# EAGLE design MainMatrix (EAGLE 9.0.1)
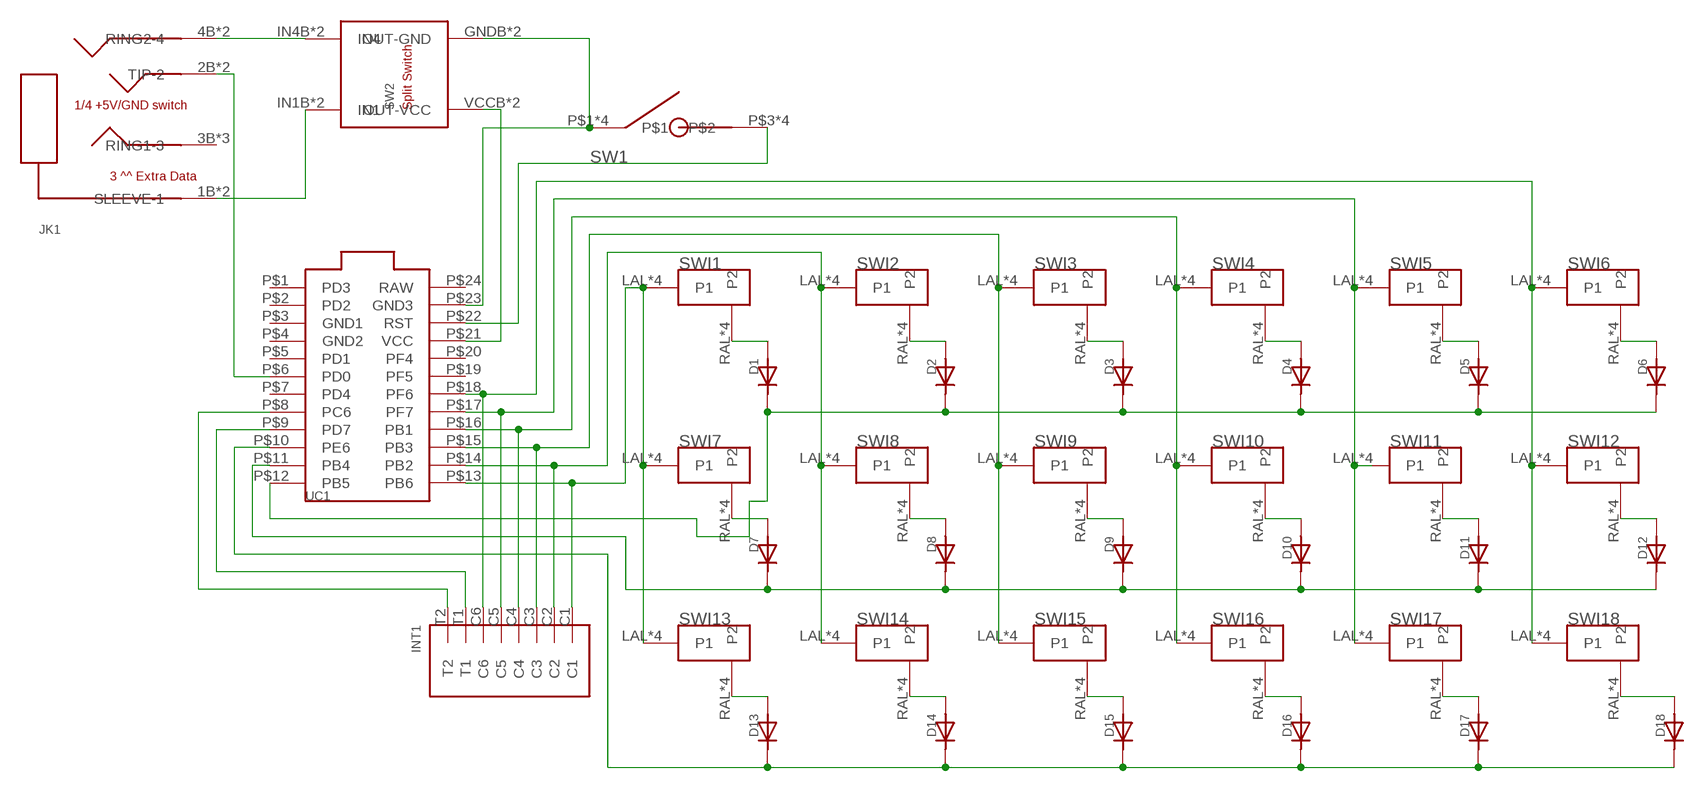
[diagram p0: schematic, sheet 1]

## Parts
D1  DIODE  [DIODE_COMBO]
D2  DIODE  [DIODE_COMBO]
D3  DIODE  [DIODE_COMBO]
D4  DIODE  [DIODE_COMBO]
D5  DIODE  [DIODE_COMBO]
D6  DIODE  [DIODE_COMBO]
D7  DIODE  [DIODE_COMBO]
D8  DIODE  [DIODE_COMBO]
D9  DIODE  [DIODE_COMBO]
D10  DIODE  [DIODE_COMBO]
D11  DIODE  [DIODE_COMBO]
D12  DIODE  [DIODE_COMBO]
D13  DIODE  [DIODE_COMBO]
D14  DIODE  [DIODE_COMBO]
D15  DIODE  [DIODE_COMBO]
D16  DIODE  [DIODE_COMBO]
D17  DIODE  [DIODE_COMBO]
D18  DIODE  [DIODE_COMBO]
INT1  INTRCNNT  [INTRCNNT]
JK1  TRRSJACK  [TRRSJACK]
SW1  RSTSWSMD  [FLATSWT]
SW2  TRANSFERPADDY  [TRANSFER_PADS]
SWI1  MX/ALPSDOUBLESIDED  [DOUBLED_MX/ALPS]
SWI2  MX/ALPSDOUBLESIDED  [DOUBLED_MX/ALPS]
SWI3  MX/ALPSDOUBLESIDED  [DOUBLED_MX/ALPS]
SWI4  MX/ALPSDOUBLESIDED  [DOUBLED_MX/ALPS]
SWI5  MX/ALPSDOUBLESIDED  [DOUBLED_MX/ALPS]
SWI6  MX/ALPSDOUBLESIDED  [DOUBLED_MX/ALPS]
SWI7  MX/ALPSDOUBLESIDED  [DOUBLED_MX/ALPS]
SWI8  MX/ALPSDOUBLESIDED  [DOUBLED_MX/ALPS]
SWI9  MX/ALPSDOUBLESIDED  [DOUBLED_MX/ALPS]
SWI10  MX/ALPSDOUBLESIDED  [DOUBLED_MX/ALPS]
SWI11  MX/ALPSDOUBLESIDED  [DOUBLED_MX/ALPS]
SWI12  MX/ALPSDOUBLESIDED  [DOUBLED_MX/ALPS]
SWI13  MX/ALPSDOUBLESIDED  [DOUBLED_MX/ALPS]
SWI14  MX/ALPSDOUBLESIDED  [DOUBLED_MX/ALPS]
SWI15  MX/ALPSDOUBLESIDED  [DOUBLED_MX/ALPS]
SWI16  MX/ALPSDOUBLESIDED  [DOUBLED_MX/ALPS]
SWI17  MX/ALPSDOUBLESIDED  [DOUBLED_MX/ALPS]
SWI18  MX/ALPSDOUBLESIDED  [DOUBLED_MX/ALPS]
UC1  PROMICROUNDER  [PROMICRO_UNDER]

## Nets
N$1: INT1.C5 SWI5.LAL(P1) SWI5.LAR(P1) SWI5.LCL(P1) SWI5.LCR(P1) SWI11.LAL(P1) SWI11.LAR(P1) SWI11.LCL(P1) SWI11.LCR(P1) SWI17.LAL(P1) SWI17.LAR(P1) SWI17.LCL(P1) SWI17.LCR(P1) UC1.P$17(PF7)
N$2: D1.ANOSB(AN) D1.ANOST(AN) D1.ANOT(AN) SWI1.RAL(P2) SWI1.RAR(P2) SWI1.RCL(P2) SWI1.RCR(P2)
N$3: D2.ANOSB(AN) D2.ANOST(AN) D2.ANOT(AN) SWI2.RAL(P2) SWI2.RAR(P2) SWI2.RCL(P2) SWI2.RCR(P2)
N$4: D3.ANOSB(AN) D3.ANOST(AN) D3.ANOT(AN) SWI3.RAL(P2) SWI3.RAR(P2) SWI3.RCL(P2) SWI3.RCR(P2)
N$5: D4.ANOSB(AN) D4.ANOST(AN) D4.ANOT(AN) SWI4.RAL(P2) SWI4.RAR(P2) SWI4.RCL(P2) SWI4.RCR(P2)
N$6: D5.ANOSB(AN) D5.ANOST(AN) D5.ANOT(AN) SWI5.RAL(P2) SWI5.RAR(P2) SWI5.RCL(P2) SWI5.RCR(P2)
N$7: D6.ANOSB(AN) D6.ANOST(AN) D6.ANOT(AN) SWI6.RAL(P2) SWI6.RAR(P2) SWI6.RCL(P2) SWI6.RCR(P2)
N$8: D7.ANOSB(AN) D7.ANOST(AN) D7.ANOT(AN) SWI7.RAL(P2) SWI7.RAR(P2) SWI7.RCL(P2) SWI7.RCR(P2)
N$9: D8.ANOSB(AN) D8.ANOST(AN) D8.ANOT(AN) SWI8.RAL(P2) SWI8.RAR(P2) SWI8.RCL(P2) SWI8.RCR(P2)
N$10: D9.ANOSB(AN) D9.ANOST(AN) D9.ANOT(AN) SWI9.RAL(P2) SWI9.RAR(P2) SWI9.RCL(P2) SWI9.RCR(P2)
N$11: D10.ANOSB(AN) D10.ANOST(AN) D10.ANOT(AN) SWI10.RAL(P2) SWI10.RAR(P2) SWI10.RCL(P2) SWI10.RCR(P2)
N$12: D11.ANOSB(AN) D11.ANOST(AN) D11.ANOT(AN) SWI11.RAL(P2) SWI11.RAR(P2) SWI11.RCL(P2) SWI11.RCR(P2)
N$13: D12.ANOSB(AN) D12.ANOST(AN) D12.ANOT(AN) SWI12.RAL(P2) SWI12.RAR(P2) SWI12.RCL(P2) SWI12.RCR(P2)
N$14: D13.ANOSB(AN) D13.ANOST(AN) D13.ANOT(AN) SWI13.RAL(P2) SWI13.RAR(P2) SWI13.RCL(P2) SWI13.RCR(P2)
N$15: D14.ANOSB(AN) D14.ANOST(AN) D14.ANOT(AN) SWI14.RAL(P2) SWI14.RAR(P2) SWI14.RCL(P2) SWI14.RCR(P2)
N$16: D15.ANOSB(AN) D15.ANOST(AN) D15.ANOT(AN) SWI15.RAL(P2) SWI15.RAR(P2) SWI15.RCL(P2) SWI15.RCR(P2)
N$17: D16.ANOSB(AN) D16.ANOST(AN) D16.ANOT(AN) SWI16.RAL(P2) SWI16.RAR(P2) SWI16.RCL(P2) SWI16.RCR(P2)
N$18: D17.ANOSB(AN) D17.ANOST(AN) D17.ANOT(AN) SWI17.RAL(P2) SWI17.RAR(P2) SWI17.RCL(P2) SWI17.RCR(P2)
N$19: D18.ANOSB(AN) D18.ANOST(AN) D18.ANOT(AN) SWI18.RAL(P2) SWI18.RAR(P2) SWI18.RCL(P2) SWI18.RCR(P2)
N$20: D1.CATSB(CAT) D1.CATST(CAT) D1.CATT(CAT) D2.CATSB(CAT) D2.CATST(CAT) D2.CATT(CAT) D3.CATSB(CAT) D3.CATST(CAT) D3.CATT(CAT) D4.CATSB(CAT) D4.CATST(CAT) D4.CATT(CAT) D5.CATSB(CAT) D5.CATST(CAT) D5.CATT(CAT) D6.CATSB(CAT) D6.CATST(CAT) D6.CATT(CAT) UC1.P$12(PB5)
N$21: D7.CATSB(CAT) D7.CATST(CAT) D7.CATT(CAT) D8.CATSB(CAT) D8.CATST(CAT) D8.CATT(CAT) D9.CATSB(CAT) D9.CATST(CAT) D9.CATT(CAT) D10.CATSB(CAT) D10.CATST(CAT) D10.CATT(CAT) D11.CATSB(CAT) D11.CATST(CAT) D11.CATT(CAT) D12.CATSB(CAT) D12.CATST(CAT) D12.CATT(CAT) UC1.P$11(PB4)
N$22: D13.CATSB(CAT) D13.CATST(CAT) D13.CATT(CAT) D14.CATSB(CAT) D14.CATST(CAT) D14.CATT(CAT) D15.CATSB(CAT) D15.CATST(CAT) D15.CATT(CAT) D16.CATSB(CAT) D16.CATST(CAT) D16.CATT(CAT) D17.CATSB(CAT) D17.CATST(CAT) D17.CATT(CAT) D18.CATSB(CAT) D18.CATST(CAT) D18.CATT(CAT) UC1.P$10(PE6)
N$23: INT1.C1 SWI1.LAL(P1) SWI1.LAR(P1) SWI1.LCL(P1) SWI1.LCR(P1) SWI7.LAL(P1) SWI7.LAR(P1) SWI7.LCL(P1) SWI7.LCR(P1) SWI13.LAL(P1) SWI13.LAR(P1) SWI13.LCL(P1) SWI13.LCR(P1) UC1.P$13(PB6)
N$24: INT1.C2 SWI2.LAL(P1) SWI2.LAR(P1) SWI2.LCL(P1) SWI2.LCR(P1) SWI8.LAL(P1) SWI8.LAR(P1) SWI8.LCL(P1) SWI8.LCR(P1) SWI14.LAL(P1) SWI14.LAR(P1) SWI14.LCL(P1) SWI14.LCR(P1) UC1.P$14(PB2)
N$25: INT1.C3 SWI3.LAL(P1) SWI3.LAR(P1) SWI3.LCL(P1) SWI3.LCR(P1) SWI9.LAL(P1) SWI9.LAR(P1) SWI9.LCL(P1) SWI9.LCR(P1) SWI15.LAL(P1) SWI15.LAR(P1) SWI15.LCL(P1) SWI15.LCR(P1) UC1.P$15(PB3)
N$26: INT1.C4 SWI4.LAL(P1) SWI4.LAR(P1) SWI4.LCL(P1) SWI4.LCR(P1) SWI10.LAL(P1) SWI10.LAR(P1) SWI10.LCL(P1) SWI10.LCR(P1) SWI16.LAL(P1) SWI16.LAR(P1) SWI16.LCL(P1) SWI16.LCR(P1) UC1.P$16(PB1)
N$27: INT1.C6 SWI6.LAL(P1) SWI6.LAR(P1) SWI6.LCL(P1) SWI6.LCR(P1) SWI12.LAL(P1) SWI12.LAR(P1) SWI12.LCL(P1) SWI12.LCR(P1) SWI18.LAL(P1) SWI18.LAR(P1) SWI18.LCL(P1) SWI18.LCR(P1) UC1.P$18(PF6)
N$28: SW2.VCCB(OUT-VCC) SW2.VCCT(OUT-VCC) UC1.P$21(VCC)
N$29: INT1.T1 UC1.P$9(PD7)
N$30: JK1.4B(RING2-4) JK1.4T(RING2-4) SW2.IN4B(IN4) SW2.IN4T(IN4)
N$31: JK1.1B(SLEEVE-1) JK1.1T(SLEEVE-1) SW2.IN1B(IN1) SW2.IN1T(IN1)
N$32: JK1.2B(TIP-2) JK1.2T(TIP-2) UC1.P$6(PD0)
N$33: INT1.T2 UC1.P$8(PC6)
N$34: SW1.P$3 SW1.P$4 SW1.P$7 SW1.P$8 UC1.P$22(RST)
N$35: SW1.P$1 SW1.P$2 SW1.P$5 SW1.P$6 SW2.GNDB(OUT-GND) SW2.GNDT(OUT-GND) UC1.P$23(GND3)
Unconnected: JK1.3B(RING1-3) JK1.3T(RING1-3) JK1.EXTRA_DATA(RING1-3) UC1.P$1(PD3) UC1.P$2(PD2) UC1.P$3(GND1) UC1.P$4(GND2) UC1.P$5(PD1) UC1.P$7(PD4) UC1.P$19(PF5) UC1.P$20(PF4) UC1.P$24(RAW)

## Library data of the parts
D1-D18 = Keys:DIODE
INT1 = Keys:INTRCNNT
JK1 = Keys:TRRSJACK
SW1 = Keys:RSTSW
SW2 = Keys:TRANSFER
SWI1-SWI18 = Keys:MX/ALPS
UC1 = Keys:PROMICRO

## Net classes
0 default: clearance 0.205 mm

## Board
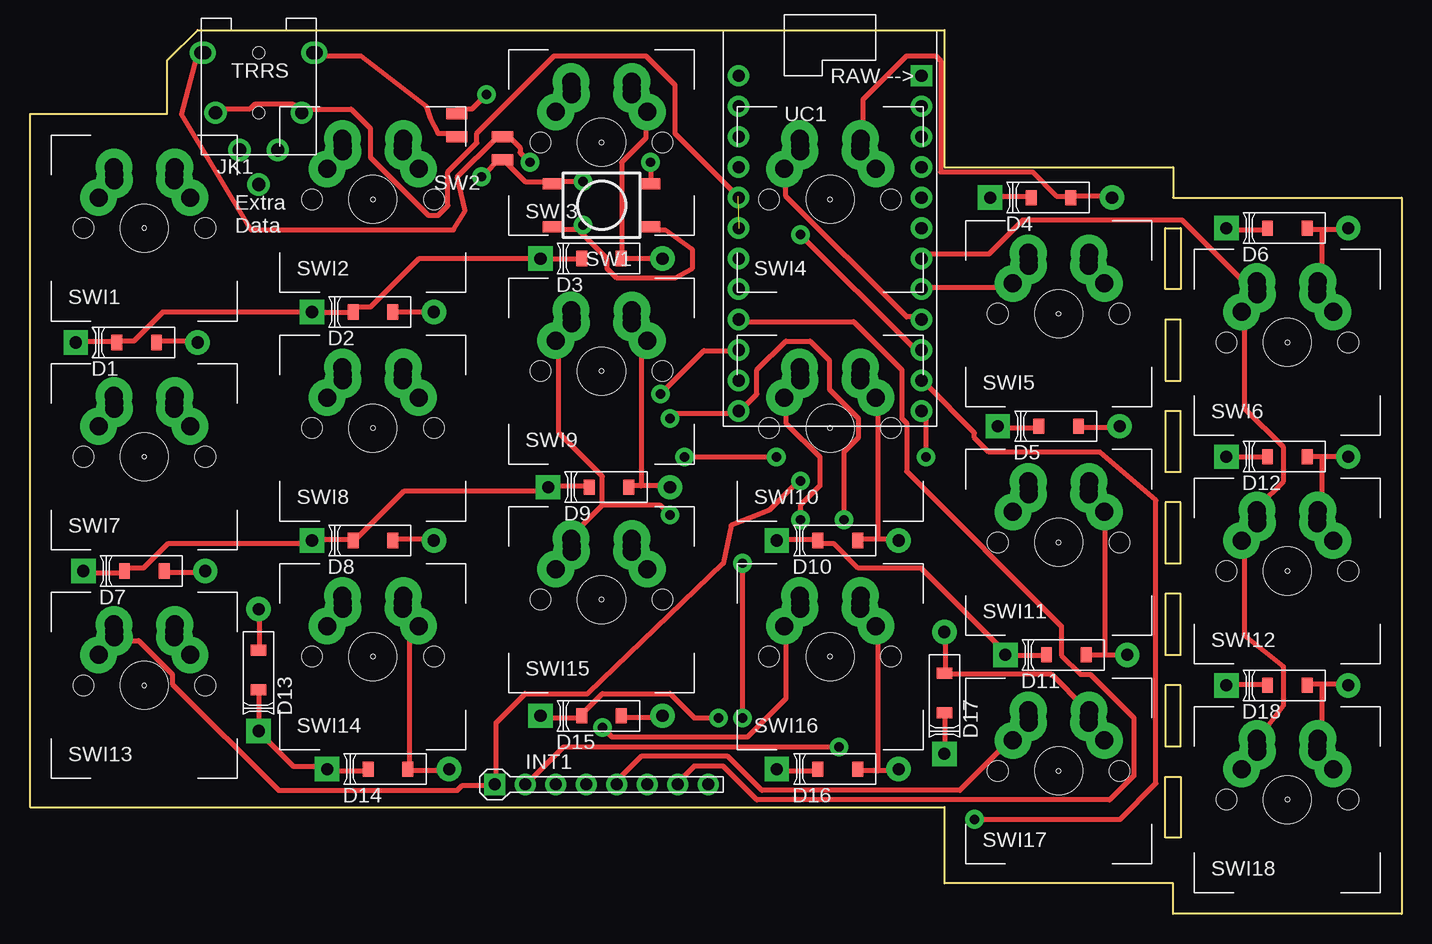
[diagram p1: board, top side]
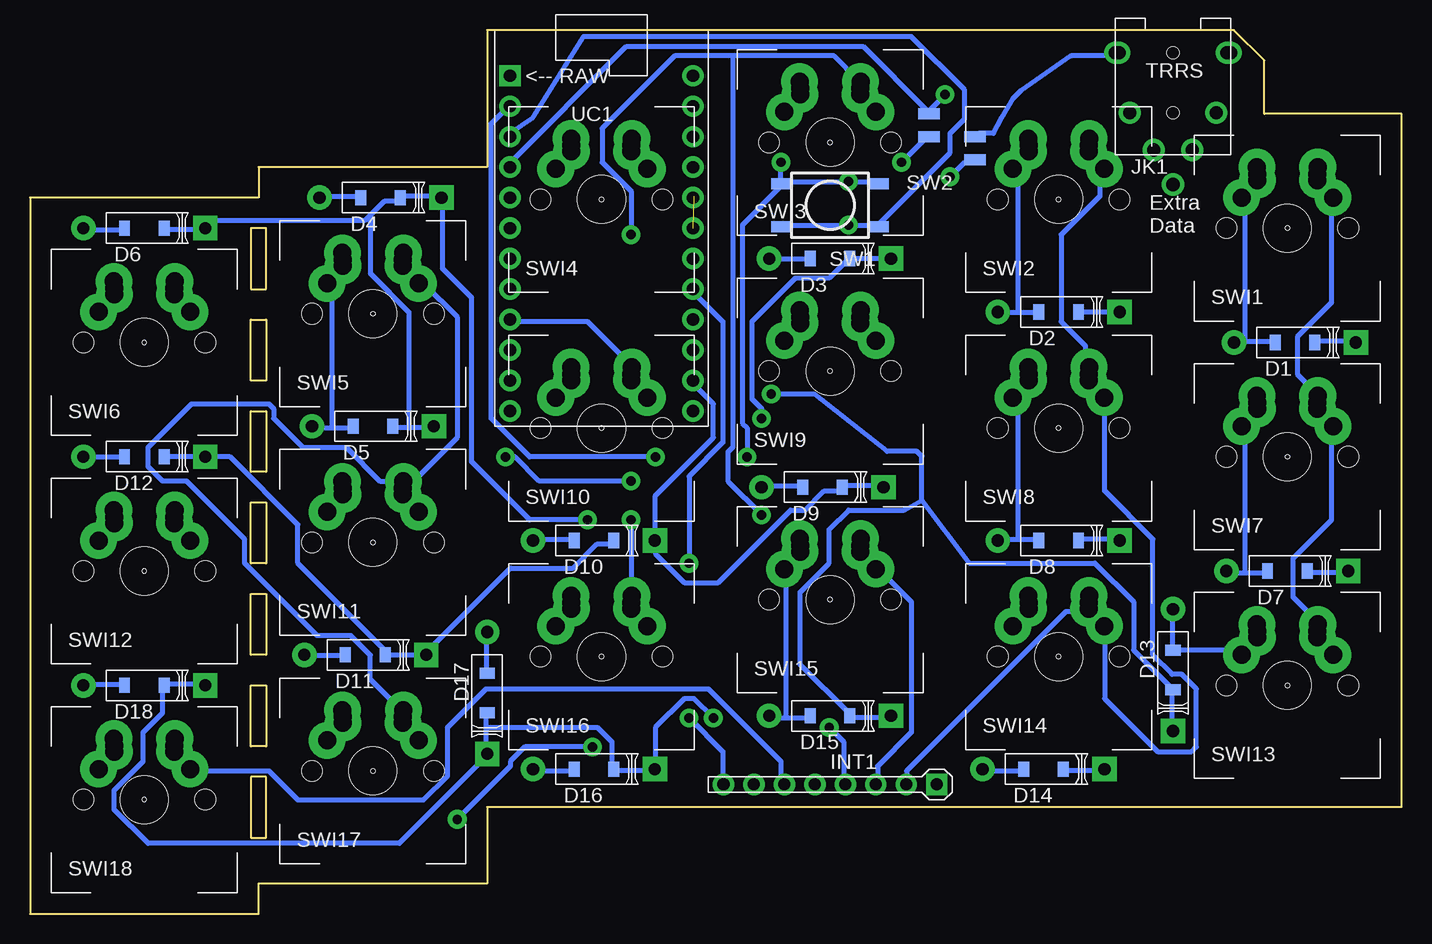
[diagram p2: board, bottom side, seen from below]

Size 114.3 x 73.66 mm. Coordinates in mm from the lower left corner, seen from the top.
Outline: 0,66.67 11.43,66.67 11.43,71.12 13.97,73.66 76.2,73.66 76.2,62.23 95.25,62.23 95.25,59.69 114.3,59.69 114.3,0 95.25,0 95.25,2.54 76.2,2.54 76.2,8.89 0,8.89 0,66.67
Outline: 94.61,57.15 95.88,57.15 95.88,52.07 94.61,52.07 94.61,57.15
Outline: 95.88,49.53 94.61,49.53 94.61,44.45 95.88,44.45 95.88,49.53
Outline: 95.88,41.91 94.61,41.91 94.61,36.83 95.88,36.83 95.88,41.91
Outline: 95.88,34.29 94.61,34.29 94.61,29.21 95.88,29.21 95.88,34.29
Outline: 95.88,26.67 94.61,26.67 94.61,21.59 95.88,21.59 95.88,26.67
Outline: 95.88,19.05 94.61,19.05 94.61,13.97 95.88,13.97 95.88,19.05
Outline: 95.88,11.43 95.88,6.35 94.61,6.35 94.61,11.43 95.88,11.43
Copper layers (1*16): Top 0.035mm / dielectric 1.5mm / Bottom 0.035mm
Design rules "ModOthermill_1_64": minimum track width 16mil, minimum drill 31mil, track to track 0.39878125mm, track to pad 0.39878125mm, pad to pad 0.39878125mm, via to via 0.39878125mm, smd to smd 0mil, copper to edge 0mil, drill to drill 1mil, minimum pad ring 15mil, minimum via ring 15mil, stop-mask expansion 1mil, vias tented up to drill 30mil, thermal gap 10mil

### Footprints (pad centres in the part's own frame; a part is rotated, then mirrored left to right if it is on the bottom)
DIODE_COMBO = smd 0.914 x 1.27 bottom: ANOSB 1.651,0; CATSB -1.651,0 | smd 0.914 x 1.27: ANOST 1.651,0; CATST -1.651,0 | drill 1.016 pad 2.032: ANOT 5.08,0 | drill 1.016 pad 2.032 square: CATT -5.08,0
INTRCNNT = drill 1.016 square: C1 0,0 | drill 1.016: C2 2.54,0; C3 5.08,0; C4 7.62,0; C5 10.16,0; C6 12.7,0; T1 15.24,0; T2 17.78,0
TRRSJACK = drill 1.1: 1B 4.5,-1.9; 1T 4.8,-1.9; 2B 3.6,-6.9; 2T -3.6,-6.9; 3B -1.6,-10; 3T 1.6,-10; 4B -4.8,-1.9; 4T -4.5,-1.9; EXTRA_DATA 0,-12.87 | hole 1: 0,-1.9; 0,-6.9
FLATSWT = smd 1.778 x 0.914: P$1 -4,-1.8; P$2 4,-1.8; P$3 -4,1.8; P$4 4,1.8 | smd 1.778 x 0.914 bottom: P$5 -4,-1.8; P$6 4,-1.8; P$7 -4,1.8; P$8 4,1.8
TRANSFER_PADS = smd 1.778 x 0.914 bottom: GNDB -1.905,-1.905; IN1B -1.905,0; IN4B 1.905,0; VCCB 1.905,1.905 | smd 1.778 x 0.914: GNDT 1.905,-1.905; IN1T -1.905,0; IN4T 1.905,0; VCCT -1.905,1.905
DOUBLED_MX/ALPS = drill 1.5 pad 3.048: LAL -2.5,4; RAL 2.5,4 | drill 1.5: LAR -2.5,4.5; RAR 2.5,4.5 | drill 1.499 pad 3.048: LCL -3.81,2.54; LCR -2.54,5.08; RCL 3.81,2.54; RCR 2.54,5.08 | hole 0.35: 0,0 | hole 3.988: 0,0 | hole 1.702: -5.08,0; 5.08,0
PROMICRO_UNDER = drill 1.016: P$1 -7.62,0; P$2 -7.62,-2.54; P$3 -7.62,-5.08; P$4 -7.62,-7.62; P$5 -7.62,-10.16; P$6 -7.62,-12.7; P$7 -7.62,-15.24; P$8 -7.62,-17.78; P$9 -7.62,-20.32; P$10 -7.62,-22.86; P$11 -7.62,-25.4; P$12 -7.62,-27.94; P$13 7.62,-27.94; P$14 7.62,-25.4; P$15 7.62,-22.86; P$16 7.62,-20.32; P$17 7.62,-17.78; P$18 7.62,-15.24; P$19 7.62,-12.7; P$20 7.62,-10.16; P$21 7.62,-7.62; P$22 7.62,-5.08; P$23 7.62,-2.54 | drill 1.016 square: P$24 7.62,0

### Placement (x,y rotation side)
D1  8.89,47.62 0 top
D2  28.57,50.16 0 top
D3  47.63,54.61 0 top
D4  85.09,59.69 0 top
D5  85.72,40.64 0 top
D6  104.78,57.15 0 top
D7  9.52,28.58 0 top
D8  28.57,31.11 0 top
D9  48.26,35.56 0 top
D10  67.31,31.11 0 top
D11  86.36,21.59 0 top
D12  104.78,38.1 0 top
D13  19.05,20.32 90 top
D14  29.85,12.06 0 top
D15  47.63,16.51 0 top
D16  67.31,12.06 0 top
D17  76.2,18.41 90 top
D18  104.78,19.05 0 top
INT1  38.74,10.79 0 top
JK1  19.05,73.66 0 top
SW1  47.63,59.05 180 top
SW2  37.46,64.77 0 top
SWI1  9.52,57.15 0 top
SWI2  28.57,59.54 0 top
SWI3  47.63,64.29 0 top
SWI4  66.68,59.54 0 top
SWI5  85.72,50.01 0 top
SWI6  104.78,47.62 0 top
SWI7  9.52,38.1 0 top
SWI8  28.57,40.49 0 top
SWI9  47.63,45.24 0 top
SWI10  66.68,40.49 0 top
SWI11  85.72,30.96 0 top
SWI12  104.78,28.58 0 top
SWI13  9.52,19.05 0 top
SWI14  28.57,21.44 0 top
SWI15  47.63,26.19 0 top
SWI16  66.68,21.44 0 top
SWI17  85.72,11.91 0 top
SWI18  104.78,9.52 0 top
UC1  66.68,69.85 0 top

### Tracks (layer width: path | path; a pad name or v marks a point on that pad's centre or on a via)
N$1
  Top 0.406: SWI11.LCR 83.53,35.67 SWI11.LAR 83.13,34.86 | 83.13,34.86 81.92,33.65 SWI11.LCL | 83.13,34.86 SWI11.LAL | SWI5.LAR 83.53,54.19 SWI5.LAL | SWI5.LAR 83.53,54.59 83.53,54.99 SWI5.LCR | UC1.P$17 74.67,52.17 81.52,52.17 SWI5.LCL 81.92,52.57 83.13,53.78 SWI5.LAR | 83.53,16.74 SWI17.LAL | 83.53,16.74 SWI17.LAR 83.13,15.54 81.92,14.33 SWI17.LCL 81.52,14.33 77.49,10.3 60.98,10.3 58.16,13.12 50.92,13.12 48.91,11.11 INT1.C5 | 83.53,16.74 SWI17.LCR
  Bottom 0.406: SWI5.LCL 81.52,52.57 78.7,49.76 78.7,39.69 82.32,36.07 83.13,36.07 SWI11.LAL 83.53,36.07 85.14,36.07 87.96,38.89 91.58,38.89 94,41.3 94,42.11 94.4,42.51 100.84,42.51 104.46,38.89 104.46,37.28 103.25,36.07 101.24,36.07 96.41,31.24 96.41,29.22 90.37,23.19 87.55,23.19 85.94,21.58 85.94,19.56 83.53,17.15 SWI17.LAR
N$2
  Top 0.406: D1.ANOST 10.66,47.74 13.88,47.74 D1.ANOT
  Bottom 0.406: 13.08,47.74 13.88,47.74 D1.ANOT 13.08,47.74 | 13.08,47.74 10.66,47.74 D1.ANOST | 13.08,47.74 13.08,59.42 SWI1.RCL
N$3
  Top 0.406: D2.ANOST 30.39,50.16 33.61,50.16 D2.ANOT
  Bottom 0.406: 32,50.16 33.61,50.16 D2.ANOT | 32,50.16 30.39,50.16 D2.ANOST | 32,50.16 32,61.83 SWI2.RCL
N$4
  Top 0.406: D3.ANOT 52.53,54.59 49.31,54.59 D3.ANOST 49.31,54.99 49.31,62.64 51.32,64.65 51.32,66.66 SWI3.RCL
  Bottom 0.406: D3.ANOST 49.31,54.59 52.53,54.59 D3.ANOT
N$5
  Top 0.406: D4.ANOT 89.97,59.82 86.75,59.82 D4.ANOST 86.35,59.82 85.54,59.82 83.53,61.83 75.88,61.83 75.88,71.09 75.48,71.5 73.06,71.5 69.44,67.87 69.44,64.65 SWI4.RAR
  Bottom 0.406: D4.ANOST 86.75,59.82 89.97,59.82 D4.ANOT
N$6
  Top 0.406: D5.ANOST 87.55,40.5 90.78,40.5 D5.ANOT
  Bottom 0.406: 89.16,40.5 90.78,40.5 D5.ANOT | 89.16,40.5 87.55,40.5 D5.ANOST | 89.16,40.5 89.16,52.17 SWI5.RCL
N$7
  Top 0.406: 107.68,57 109.7,57 D6.ANOT | 107.68,57 106.48,57 D6.ANOST | 107.68,57 107.68,52.98 SWI6.RAL
  Bottom 0.406: D6.ANOST 106.48,57 109.7,57 D6.ANOT
N$8
  Top 0.406: D7.ANOST 11.46,28.42 14.28,28.42 D7.ANOT
  Bottom 0.406: 13.08,28.42 14.28,28.42 D7.ANOT | 13.08,28.42 11.46,28.42 D7.ANOST | 13.08,28.42 13.08,40.5 SWI7.RCL
N$9
  Top 0.406: D8.ANOST 30.39,31.24 33.61,31.24 D8.ANOT
  Bottom 0.406: 32,31.24 33.61,31.24 D8.ANOT | 32,31.24 30.39,31.24 D8.ANOST | 32,31.24 32,42.91 SWI8.RCL
N$10
  Top 0.406: 50.92,35.67 53.33,35.67 D9.ANOT | 50.92,35.67 50.11,35.67 D9.ANOST | 50.92,35.67 50.92,47.34 51.32,47.74 SWI9.RCL
  Bottom 0.406: D9.ANOST 50.11,35.67 53.33,35.67 D9.ANOT
N$11
  Top 0.406: 70.65,31.24 72.26,31.24 D10.ANOT | 70.65,31.24 69.03,31.24 D10.ANOST | 70.65,31.24 70.65,42.91 SWI10.RCL
  Bottom 0.406: D10.ANOST 69.03,31.24 72.26,31.24 D10.ANOT
N$12
  Top 0.406: 89.57,21.58 91.18,21.58 D11.ANOT | 89.57,21.58 88.36,21.58 D11.ANOST | 89.57,21.58 89.57,33.25 SWI11.RCL
  Bottom 0.406: D11.ANOST 88.36,21.58 91.18,21.58 D11.ANOT
N$13
  Top 0.406: 107.68,38.08 109.7,38.08 D12.ANOT | 107.68,38.08 106.48,38.08 D12.ANOST | 107.68,38.08 107.68,34.05 SWI12.RCR
  Bottom 0.406: D12.ANOST 106.48,38.08 109.7,38.08 D12.ANOT
N$14
  Top 0.406: D13.ANOST 19.11,21.98 19.11,25.2 D13.ANOT
  Bottom 0.406: D13.ANOT 19.11,25.2 19.11,21.98 D13.ANOST 18.71,21.98 13.48,21.98 SWI13.RCL
N$15
  Top 0.406: D14.ANOT 34.82,11.91 31.59,11.91 D14.ANOST 31.59,12.31 31.59,23.19 32,23.59 SWI14.RCL
  Bottom 0.406: D14.ANOST 31.59,11.91 34.82,11.91 D14.ANOT
N$16
  Top 0.406: D15.ANOST 49.31,16.34 52.53,16.34 D15.ANOT
  Bottom 0.406: 51.32,16.34 52.53,16.34 D15.ANOT | 51.32,16.34 49.31,16.34 D15.ANOST | 51.32,16.34 51.32,28.42 SWI15.RCL
N$17
  Top 0.406: 70.65,11.91 72.26,11.91 D16.ANOT | 70.65,11.91 69.03,11.91 D16.ANOST | 70.65,11.91 70.65,23.59 SWI16.RCL
  Bottom 0.406: D16.ANOST 69.03,11.91 72.26,11.91 D16.ANOT
N$18
  Top 0.406: D17.ANOT 76.28,23.19 76.28,20.37 D17.ANOST 76.28,19.97 85.14,19.97 87.96,17.15 SWI17.RAR
  Bottom 0.406: D17.ANOST 76.28,20.37 76.28,23.19 D17.ANOT
N$19
  Top 0.406: 107.68,19.16 109.7,19.16 D18.ANOT | 107.68,19.16 106.48,19.16 D18.ANOST | 107.68,19.16 107.68,14.73 SWI18.RAL
  Bottom 0.406: D18.ANOST 106.48,19.16 109.7,19.16 D18.ANOT
N$20  (via drill 0.79)
  Top 0.406: D5.CATST 83.93,40.5 80.71,40.5 D5.CATT | D4.CATST 83.13,59.82 80.31,59.82 D4.CATT | D6.CATST 102.85,57 100.03,57 D6.CATT | D1.CATT 3.82,47.74 7.04,47.74 D1.CATST 7.44,47.74 8.65,47.74 11.06,50.16 23.14,50.16 D2.CATT 23.54,50.16 26.76,50.16 D2.CATST 27.16,50.56 28.37,50.56 32.4,54.59 42.46,54.59 D3.CATT 42.87,54.59 45.68,54.59 D3.CATST | v53.33,41.3 53.74,41.7 58.97,41.7 UC1.P$12 59.37,42.11 60.58,43.31 60.58,45.33 63,47.74 65.01,47.74 66.62,46.13 66.62,43.72 69.03,41.3 69.03,39.69 67.83,38.48 v67.83,32.85
  Bottom 0.406: 82.72,40.5 80.71,40.5 D5.CATT | 82.72,40.5 83.93,40.5 D5.CATST | D6.CATST 102.85,57 100.03,57 D6.CATT 99.63,57.41 99.23,57.81 86.35,57.81 85.94,58.21 | 85.94,58.21 84.74,59.42 83.53,59.42 D4.CATST 83.13,59.82 80.31,59.82 D4.CATT 79.91,59.42 79.91,53.78 77.49,51.37 77.49,37.68 72.66,32.85 v67.83,32.85 | 82.72,40.5 82.72,50.16 85.94,53.38 85.94,58.21 | D1.CATST 7.04,47.74 3.82,47.74 D1.CATT | D2.CATST 26.76,50.16 23.54,50.16 D2.CATT | D3.CATT 42.87,54.59 45.68,54.59 D3.CATST 46.09,54.59 47.7,52.98 50.52,52.98 54.14,49.35 54.14,42.91 53.33,42.11 v53.33,41.3
N$21
  Top 0.406: D9.CATST 46.49,35.67 43.27,35.67 D9.CATT 42.87,35.26 31.19,35.26 27.16,31.24 D8.CATST 26.76,31.24 23.54,31.24 D8.CATT 23.14,30.83 11.46,30.83 9.45,28.82 8.24,28.82 D7.CATST 7.84,28.42 4.62,28.42 D7.CATT | D10.CATT 62.59,31.24 65.41,31.24 D10.CATST 65.81,30.83 67.02,30.83 69.03,28.82 74.27,28.82 81.11,21.98 D11.CATT 81.52,21.58 84.33,21.58 D11.CATST | D12.CATST 102.85,38.08 100.03,38.08 D12.CATT
  Bottom 0.406: D9.CATT 43.27,35.67 46.49,35.67 D9.CATST 46.89,35.26 48.1,35.26 49.71,33.65 50.92,33.65 56.96,27.61 59.77,27.61 62.19,30.03 62.19,30.83 D10.CATT 62.19,31.24 62.19,34.86 57.36,39.69 57.36,42.51 58.97,44.12 UC1.P$11 | D7.CATST 7.84,28.42 4.62,28.42 D7.CATT | D8.CATST 26.76,31.24 23.54,31.24 D8.CATT | D12.CATST 102.85,38.08 100.03,38.08 D12.CATT 99.63,38.08 97.62,38.08 91.98,32.44 91.98,29.22 84.74,21.98 D11.CATST 84.33,21.58 81.52,21.58 D11.CATT 81.11,21.98 74.27,28.82 69.03,28.82 67.02,30.83 65.81,30.83 D10.CATST
N$22  (via drill 0.79)
  Top 0.406: D18.CATST 102.85,19.16 100.03,19.16 D18.CATT | D16.CATST 65.41,11.91 62.59,11.91 D16.CATT | D17.CATST 76.28,16.74 76.28,13.52 D17.CATT | D14.CATST 27.97,11.91 25.15,11.91 D14.CATT 24.75,12.31 21.93,12.31 19.11,15.13 D13.CATT 19.11,15.54 19.11,18.35 D13.CATST | D15.CATT 42.87,16.34 45.68,16.34 D15.CATST 46.09,16.74 47.7,18.35 53.33,18.35 55.35,16.34 v57.36,16.34 | v52.53,43.31 56.15,46.94 58.97,46.94 UC1.P$10
  Bottom 0.406: D18.CATT 100.03,19.16 102.85,19.16 D18.CATST 103.25,18.76 103.25,16.74 104.86,15.13 104.86,12.72 107.28,10.3 107.28,8.69 104.46,5.87 83.53,5.87 76.28,13.12 D17.CATT 76.28,13.52 76.28,15.54 | 76.28,15.54 76.28,16.74 D17.CATST | 76.28,15.54 67.02,15.54 65.81,14.33 65.81,12.31 D16.CATST 65.41,11.91 62.59,11.91 D16.CATT 62.19,12.31 62.19,15.54 59.77,17.95 58.97,17.95 v57.36,16.34 | D14.CATST 27.97,11.91 25.15,11.91 D14.CATT | D13.CATT 19.11,15.54 19.11,18.35 D13.CATST 19.11,18.76 22.33,21.98 22.33,26 25.55,29.22 36.02,29.22 39.99,34.46 | D15.CATT 42.87,16.34 45.68,16.34 D15.CATST 46.09,16.74 50.11,20.77 50.11,26.81 47.7,29.22 47.7,32.04 46.09,33.65 41.43,33.65 39.99,34.46 | v52.53,43.31 48.91,43.31 42.87,38.55 40.39,38.55 39.99,38.14 39.99,34.46
N$23  (via drill 0.79)
  Top 0.406: 7.04,61.83 SWI1.LAL | SWI1.LCL 5.83,59.82 7.04,61.03 SWI1.LAR 7.04,61.83 | 7.04,61.83 SWI1.LCR | SWI7.LAR 7.04,42.91 SWI7.LCR | SWI7.LCL 5.83,40.9 6.63,41.7 SWI7.LAR | SWI7.LAL 6.63,42.11 SWI7.LAR | SWI13.LAR 7.04,22.78 9.05,22.78 11.87,19.97 11.87,19.16 20.72,10.3 35.62,10.3 36.02,10.7 38.44,10.7 INT1.C1 38.84,11.11 38.84,15.94 41.26,18.35 46.49,18.35 57.79,29.21 58.42,32.38 61.6,33.66 64.01,36.07 v64.2,36.07 | v74.67,38.08 74.67,41.7 UC1.P$13 | SWI13.LCL 5.83,21.98 6.63,22.78 SWI13.LAR | SWI13.LAR 7.04,23.59 7.04,23.99 SWI13.LCR 7.04,23.19 SWI13.LAL
  Bottom 0.406: v74.67,38.08 73.87,38.08 71.85,36.07 v64.2,36.07 | SWI7.LCL 5.83,40.5 5.83,32.85 9.05,29.63 9.05,26.41 7.04,24.39 SWI13.LAL | SWI1.LCL 5.83,59.42 5.83,50.96 8.65,48.15 8.65,44.92 7.04,43.31 SWI7.LAL
N$24  (via drill 0.79)
  Top 0.406: SWI8.LAR 26.36,45.33 SWI8.LCR | SWI8.LCL 25.15,43.31 25.96,44.12 SWI8.LAR | SWI8.LAL 25.96,44.52 SWI8.LAR | SWI2.LCR 26.36,64.25 SWI2.LAR 26.36,63.44 | 26.36,63.44 25.15,62.24 SWI2.LCL | 26.36,63.44 SWI2.LAL | v78.7,7.89 90.84,7.89 93.82,10.88 93.82,34.46 89.16,38.48 79.91,38.48 78.7,39.69 78.7,40.09 74.67,44.12 UC1.P$14 | v67.42,13.93 44.48,13.93 41.66,11.11 INT1.C2 | SWI14.LCL 25.15,23.99 26.36,25.2 SWI14.LAR 26.36,25.6 SWI14.LAL 25.96,26 25.96,26.41 SWI14.LCR
  Bottom 0.406: SWI8.LAL 26.36,45.73 26.36,47.34 28.37,49.35 28.37,56.6 25.15,59.82 25.15,61.83 SWI2.LCL | INT1.C2 41.26,11.11 41.26,11.91 27.97,25.2 26.36,25.2 SWI14.LAR | v78.7,7.89 74.27,12.31 74.27,12.72 73.06,13.93 v67.42,13.93 | SWI8.LCL 24.75,42.91 24.75,35.26 20.72,31.24 20.72,21.58 19.11,19.97 18.31,19.97 17.1,18.76 17.1,13.93 17.5,13.52 20.32,13.52 24.75,17.95 24.75,23.59 SWI14.LCL
N$25  (via drill 0.79)
  Top 0.406: SWI9.LAL 45.28,49.35 SWI9.LAR 44.88,49.76 SWI9.LCR 44.88,48.95 44.07,48.15 SWI9.LCL 44.07,47.74 44.07,40.09 47.7,36.47 47.7,34.05 | SWI15.LAL 45.28,30.43 SWI15.LAR 45.28,30.83 45.28,31.24 SWI15.LCR | SWI15.LCR 44.88,30.03 43.67,28.82 SWI15.LCL | 47.7,34.05 45.28,31.64 SWI15.LCR | v64.2,56.6 73.46,47.34 74.27,47.34 UC1.P$15 | 45.28,68.27 44.07,67.07 SWI3.LCL | 45.28,68.27 SWI3.LAR | 45.28,68.27 SWI3.LAL | 45.28,68.27 SWI3.LCR | 47.7,34.05 52.53,34.05 v53.33,33.25
  Bottom 0.406: INT1.C3 43.67,11.11 43.67,12.31 40.85,15.13 40.85,26 43.67,28.82 SWI15.LCL | v64.2,56.6 64.2,60.22 66.62,62.64 66.62,65.46 60.58,71.5 55.75,71.5 | 55.75,71.5 47.29,71.5 45.28,69.48 | 45.28,69.48 SWI3.LCR | 45.28,69.48 SWI3.LAR | v53.33,33.25 56.15,36.07 56.15,38.48 55.75,38.89 55.75,71.5
N$26  (via drill 0.79)
  Top 0.406: SWI16.LAR 64.2,25.6 SWI16.LAL | SWI16.LAR 64.2,26 64.2,26.41 SWI16.LCR | v47.7,15.54 48.5,14.73 59.77,14.73 63,17.95 63,23.59 SWI16.LCL 62.59,23.99 63.8,25.2 SWI16.LAR | SWI4.LCR 64.2,64.25 SWI4.LAR 64.2,63.44 | 64.2,63.44 63,62.24 SWI4.LCL 63,61.83 63,59.82 73.06,49.76 74.27,49.76 UC1.P$16 | 64.2,63.44 SWI4.LAL | SWI10.LAL 63.8,44.52 SWI10.LAR 63.8,44.12 63,43.31 SWI10.LCL 63,42.91 63,40.9 65.81,38.08 65.81,35.67 64.2,34.05 v64.2,32.85
  Bottom 0.406: v47.7,15.54 46.49,14.33 46.49,11.11 INT1.C4 | 64.2,45.73 67.83,49.35 74.27,49.35 UC1.P$16 | 64.2,45.73 SWI10.LAR | 64.2,45.73 SWI10.LCR | 64.2,45.73 SWI10.LAL | v64.2,32.85 64.2,26.81 SWI16.LAR
N$27
  Top 0.406: 102.05,52.98 100.84,52.98 96.01,57.81 82.72,57.81 79.91,54.99 74.67,54.99 UC1.P$18 | 102.05,52.98 SWI6.LAL 102.05,52.17 SWI6.LAR | SWI6.LAR 102.05,51.37 101.24,50.56 SWI6.LCL 101.24,50.16 101.24,42.11 104.46,38.89 104.46,36.07 102.45,34.05 SWI12.LAL 102.45,32.85 | 102.05,52.98 SWI6.LCR | 102.05,52.98 SWI6.LAR | 102.45,32.85 SWI12.LCR | 102.45,32.85 SWI12.LAR 102.45,32.44 101.24,31.24 SWI12.LCL 101.24,30.83 101.24,23.19 104.46,20.6 104.46,17.38 102.45,14.73 SWI18.LAL | 102.45,13.93 SWI18.LCR | 102.45,13.93 SWI18.LAL | 102.45,13.93 SWI18.LAR | SWI18.LAL 102.05,13.52 100.84,12.31 SWI18.LCL
  Bottom 0.406: INT1.C6 51.72,11.11 51.72,12.72 57.76,18.76 76.28,18.76 79.5,15.54 79.5,11.51 81.52,9.5 91.98,9.5 94.4,11.91 100.84,11.91 SWI18.LCL
N$28  (via drill 0.79)
  Top 0.406: v38.04,68.27 36.83,67.07 35.62,67.07 SW2.VCCT
  Bottom 0.406: v38.04,68.27 39.24,67.07 SW2.VCCB 39.65,67.07 44.88,72.3 64.61,72.3 74.67,62.24 UC1.P$21
N$29
  Top 0.406: INT1.T1 54.14,11.11 55.35,12.31 57.76,12.31 60.58,9.5 89.97,9.5 91.98,11.51 91.98,16.34 88.36,19.97 87.55,19.97 85.94,21.58 85.94,23.99 73.06,36.87 73.06,40.9 72.66,41.3 72.66,45.33 68.63,49.35 59.37,49.35 UC1.P$9
N$30  (via drill 0.79)
  Top 0.406: v41.66,62.64 40.85,63.44 40.85,63.85 39.65,65.05 SW2.IN4B 39.24,64.65 38.84,64.65 35.62,61.43 36.26,58.61 35.28,57 18.42,57 12.61,66.62 13.88,71.5 JK1.4B 14.28,71.9 JK1.4T
  Bottom 0.406: v41.66,62.64 39.65,64.65 SW2.IN4B
N$31
  Top 0.406: SW2.IN1T 35.22,65.05 34.01,65.05 33.37,66.32 33.02,67.31 27.57,71.5 23.95,71.5 JK1.1B 23.95,71.9 JK1.1T
  Bottom 0.406: SW2.IN1T 35.22,65.05 34.01,65.05 33.37,66.32 32.38,67.94 31.75,68.58 27.57,71.5 23.95,71.5 JK1.1B
N$32  (1 unrouted)
  Top 0.406: 58.97,59.82 53.74,65.05 53.74,69.08 51.32,71.5 43.67,71.5 37.23,65.05 37.23,64.25 34.82,61.83 34.82,59.02 34.01,58.21 33.2,58.21 28.37,63.04 28.37,65.46 26.76,67.07 22.74,67.07 JK1.2B 22.33,67.07 21.93,67.47 18.71,67.47 18.31,67.07 15.49,67.07 JK1.2T
N$33  (via drill 0.79)
  Top 0.406: v59.37,29.22 v59.37,16.34
  Bottom 0.406: v59.37,16.34 56.55,13.52 56.55,11.11 INT1.T2 | v59.37,29.22 59.37,36.47 56.55,39.29 56.55,49.35 58.97,51.77 UC1.P$8
N$34  (via drill 0.79)
  Top 0.406: 45.68,57 43.67,57 SW1.P$8 | 45.68,57 48.1,54.59 48.1,53.78 48.91,52.98 53.74,52.98 55.18,53.78 55.18,55.39 52.93,57 51.72,57 SW1.P$7 | v46.09,57.41 45.68,57
  Bottom 0.406: 43.67,57.41 v46.09,57.41 51.32,57.41 SW1.P$7 | 43.67,57.41 37.63,63.44 37.63,65.05 36.43,66.26 36.43,68.68 40.85,73.11 68.18,73.11 72.43,66.33 74.27,65.05 UC1.P$22 | 43.67,57.41 SW1.P$8
N$35  (via drill 0.79)
  Top 0.406: v37.63,61.43 39.24,63.04 SW2.GNDT 39.65,62.64 41.26,61.03 43.27,61.03 SW1.P$6 43.67,61.03 v46.09,61.03 | v51.72,62.64 51.72,61.03 SW1.P$5 | v54.54,38.08 v62.19,38.08
  Bottom 0.406: v37.63,61.43 36.43,62.64 35.62,62.64 SW2.GNDB | SW1.P$6 43.67,61.03 v46.09,61.03 51.32,61.03 SW1.P$5 | v51.72,62.64 51.72,61.03 SW1.P$5 | v62.19,38.08 72.66,38.08 75.88,41.3 75.88,65.86 74.67,67.07 UC1.P$23 | v54.54,38.08 54.54,40.5 54.94,40.9 54.94,57.41 51.72,60.63 SW1.P$5